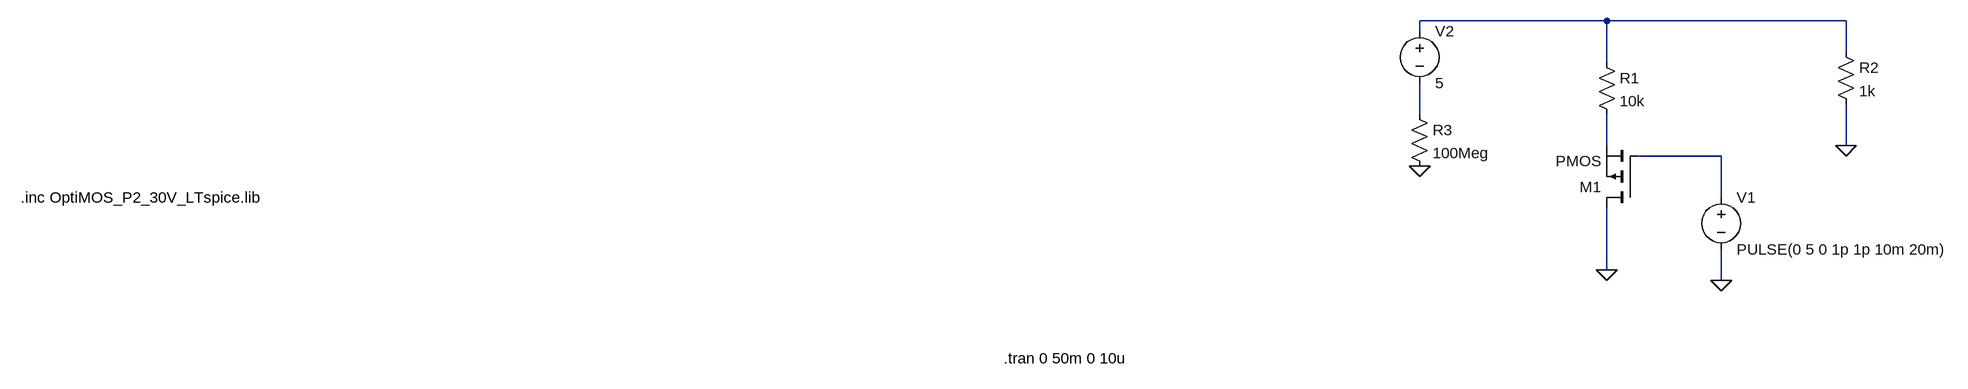
[diagram p0: schematic version0_pmos.asc]
version0_pmos.asc, the LTspice schematic file:
Version 4.1
SHEET 1 1280 680
WIRE 736 -240 448 -240
WIRE 1104 -240 736 -240
WIRE 448 -224 448 -240
WIRE 1104 -192 1104 -240
WIRE 736 -176 736 -240
WIRE 448 -96 448 -144
WIRE 736 -48 736 -96
WIRE 1104 -48 1104 -112
WIRE 912 -32 784 -32
WIRE 912 32 912 -32
WIRE 736 144 736 48
WIRE 912 160 912 112
FLAG 736 144 0
FLAG 912 160 0
FLAG 1104 -48 0
FLAG 448 -16 0
SYMBOL pmos 784 48 R180
SYMATTR InstName M1
SYMBOL res 720 -192 R0
SYMATTR InstName R1
SYMATTR Value 10k
SYMBOL voltage 912 16 R0
WINDOW 123 0 0 Left 0
WINDOW 39 0 0 Left 0
SYMATTR InstName V1
SYMATTR Value PULSE(0 5 0 1p 1p 10m 20m)
SYMBOL res 1088 -208 R0
SYMATTR InstName R2
SYMATTR Value 1k
SYMBOL voltage 448 -240 R0
WINDOW 123 0 0 Left 0
WINDOW 39 0 0 Left 0
SYMATTR InstName V2
SYMATTR Value 5
SYMBOL res 432 -112 R0
SYMATTR InstName R3
SYMATTR Value 100Meg
TEXT -1704 32 Left 2 !.inc OptiMOS_P2_30V_LTspice.lib
TEXT -192 280 Left 2 !.tran 0 50m 0 10u

The netlist it stands for:
* version0_pmos.asc
M1 0 N004 N003 N003 PMOS
R1 N001 N003 10k
V1 N004 0 PULSE(0 5 0 1p 1p 10m 20m)
R2 N001 0 1k
V2 N001 N002 5
R3 N002 0 100Meg
.model NMOS NMOS
.model PMOS PMOS
.lib standard.mos
.inc OptiMOS_P2_30V_LTspice.lib
.tran 0 50m 0 10u
.backanno
.end